# Altium schematic sheet USB_debug_schematic.SchDoc: USB UART debug circuit
size A3; Organization: Altium Limited; Address1: L3, 12a Rodborough Rd; Address2: Frenchs Forest; Address3: NSW; Address4: Australia 2086; DocumentNumber: 8; SheetNumber: 8; SheetTotal: 8
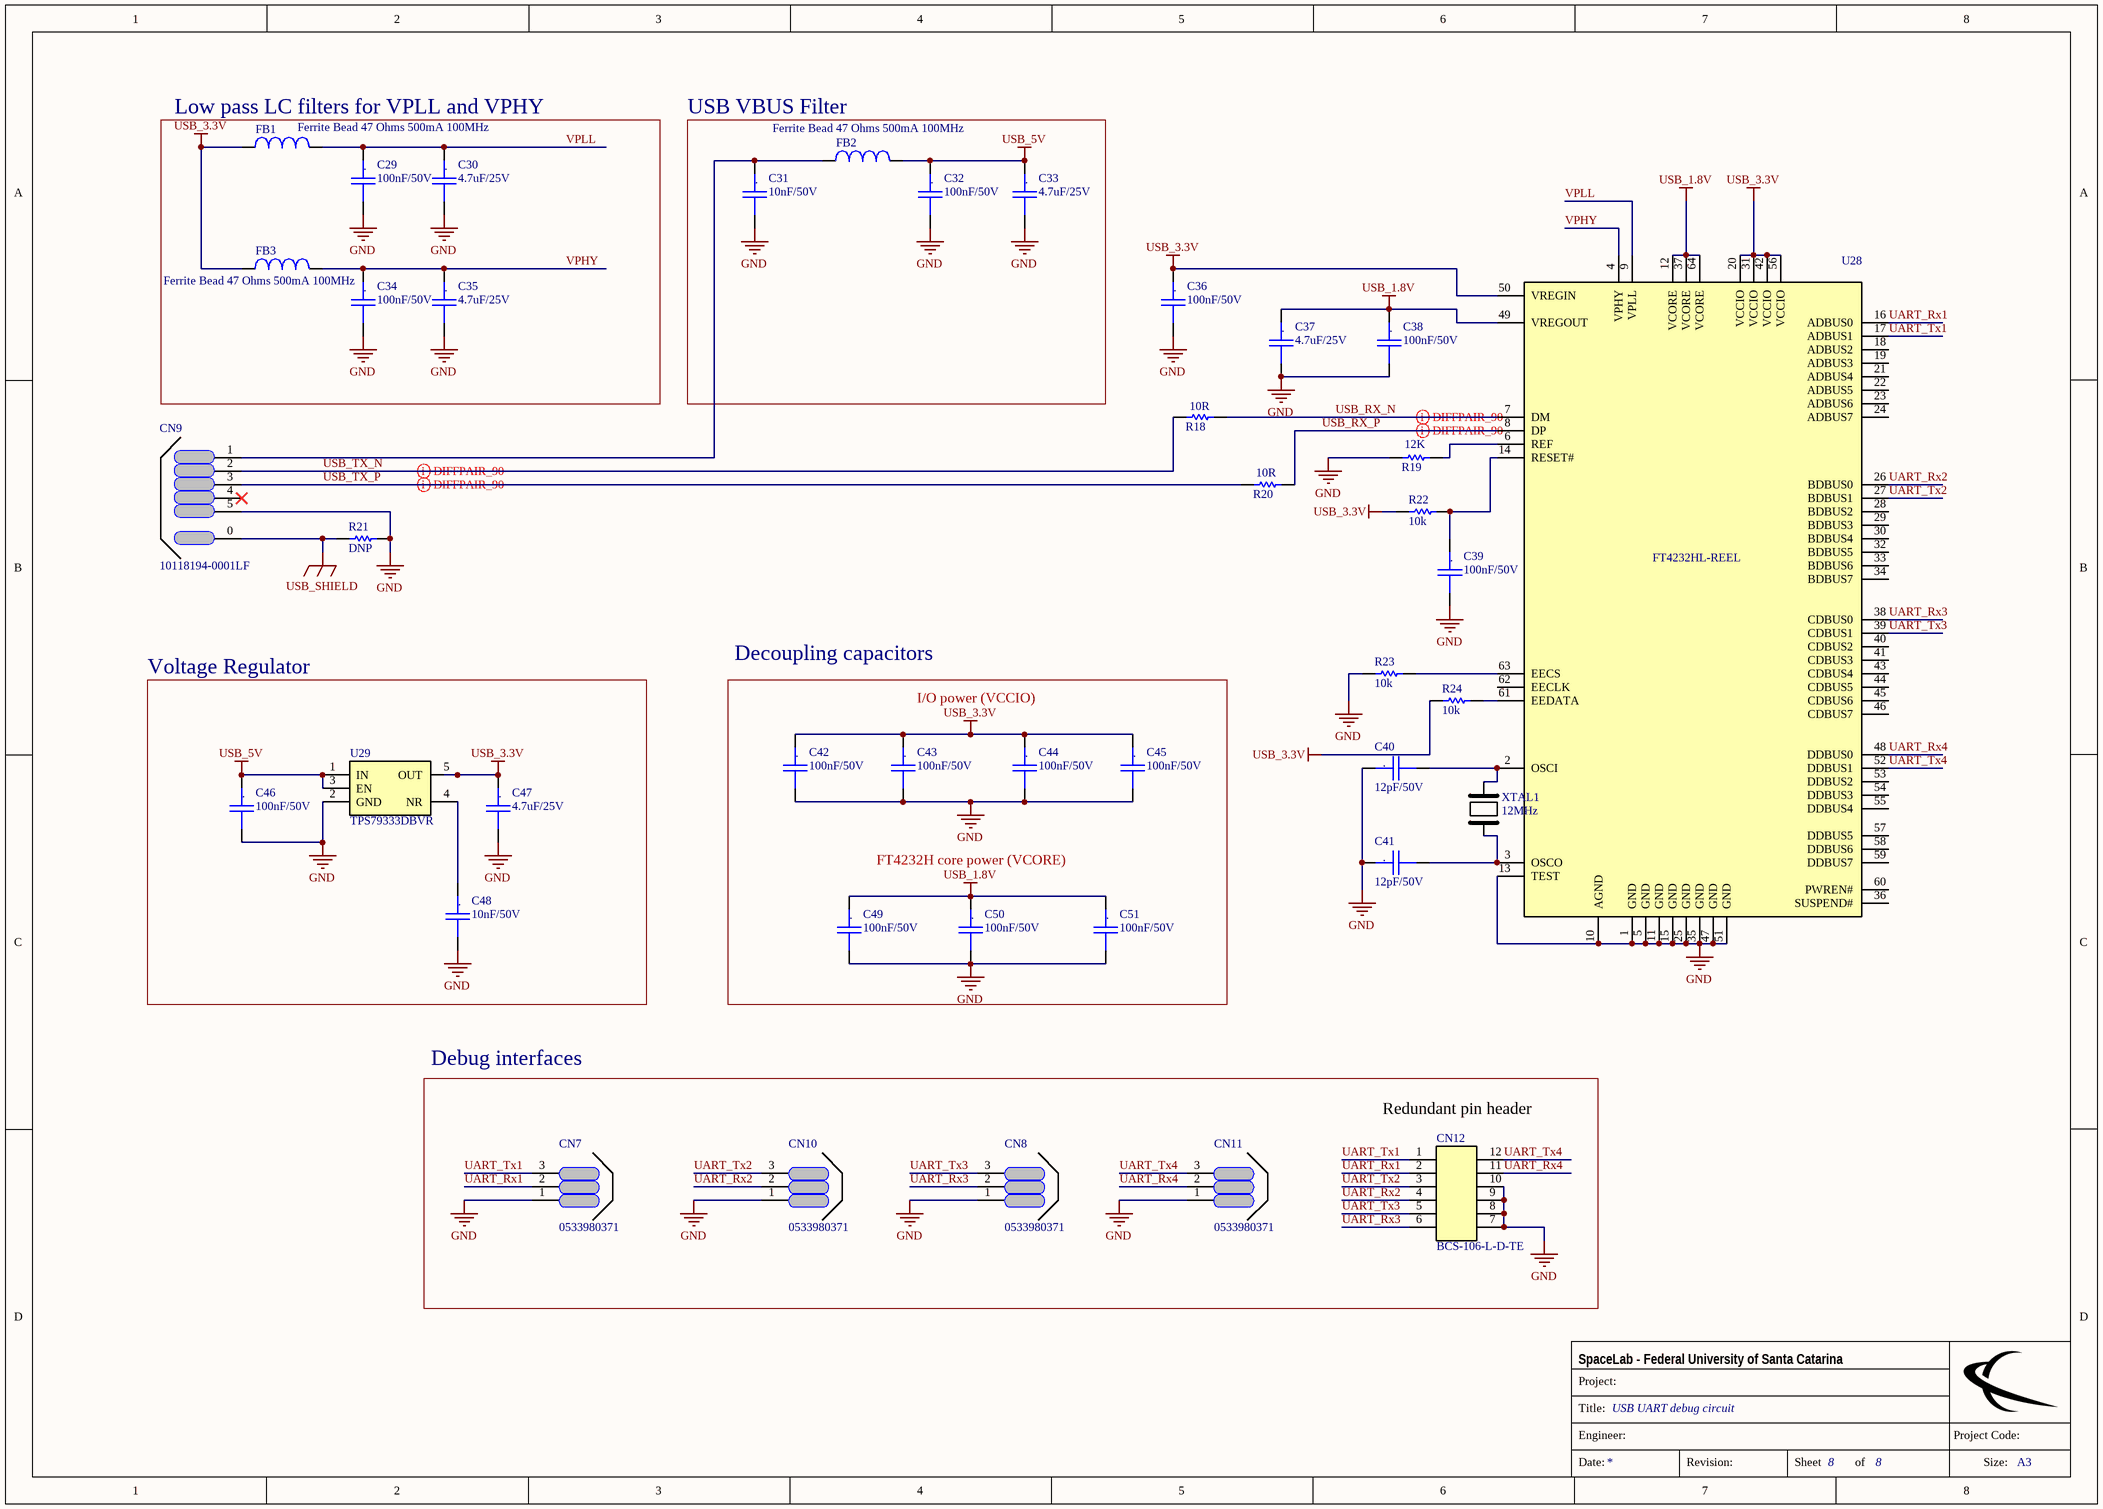
[diagram p0: USB_debug_schematic.SchDoc]

## Parts
C29  100nF/50V  [CC0603]
C30  4.7uF/25V  [CC0805]
C31  10nF/50V  [CC0805]
C32  100nF/50V  [CC0603]
C33  4.7uF/25V  [CC0805]
C34  100nF/50V  [CC0603]
C35  4.7uF/25V  [CC0805]
C36  100nF/50V  [CC0603]
C37  4.7uF/25V  [CC0805]
C38  100nF/50V  [CC0603]
C39  100nF/50V  [CC0603]
C40  12pF/50V  [CC0805]
C41  12pF/50V  [CC0805]
C42  100nF/50V  [CC0603]
C43  100nF/50V  [CC0603]
C44  100nF/50V  [CC0603]
C45  100nF/50V  [CC0603]
C46  100nF/50V  [CC0603]
C47  4.7uF/25V  [CC0805]
C48  10nF/50V  [CC0805]
C49  100nF/50V  [CC0603]
C50  100nF/50V  [CC0603]
C51  100nF/50V  [CC0603]
CN7  0533980371  [PICO BLADE 0533980371]
CN8  0533980371  [PICO BLADE 0533980371]
CN9  10118194-0001LF  [MICRO USB B 90GRAUS]
CN10  0533980371  [PICO BLADE 0533980371]
CN11  0533980371  [PICO BLADE 0533980371]
CN12  BCS-106-L-D-TE  [BCS-106-L-D-TE]
FB1  Ferrite Bead 47 Ohms 500mA 100MHz  [L0603]
FB2  Ferrite Bead 47 Ohms 500mA 100MHz  [L0603]
FB3  Ferrite Bead 47 Ohms 500mA 100MHz  [L0603]
R18  10R  [R0603_MD]
R19  12K  [R0805_MD]
R20  10R  [R0603_MD]
R21  DNP  [0805]
R22  10k  [0805]
R23  10k  [0805]
R24  10k  [0805]
U28  FT4232HL-REEL  [LQFP-64]
U29  TPS79333DBVR  [SOT23-5]
XTAL1  Frequency: 12MHz  [TXC 7A Series]  (hidden comment: 12.000MHz 12pF)

## Blocks framed on the sheet
Low pass LC filters for VPLL and VPHY: C29 C30 C34 C35 FB1 FB3
USB VBUS Filter: C31-C33 FB2
Voltage Regulator: C46-C48 U29
Decoupling capacitors: C42-C45 C49-C51
Debug interfaces: CN7 CN8 CN10-CN12

## Nets
GND: C29.2 C30.2 C31.2 C32.2 C33.2 C34.2 C35.2 C36.2 C37.2 C38.2 C39.2 C40.1 C41.1 C42.2 C43.2 C44.2 C45.2 C46.2 C47.2 C48.2 C49.2 C50.2 C51.2 CN7.1 CN8.1 CN9.5 CN10.1 CN11.1 CN12.7 CN12.8 CN12.9 CN12.10 R19.1 R21.1 R23.2 U28.1(GND) U28.5(GND) U28.10(AGND) U28.11(GND) U28.13(TEST) U28.15(GND) U28.25(GND) U28.35(GND) U28.47(GND) U28.51(GND) U29.2(GND)
USB_1.8V: C37.1 C38.1 C49.1 C50.1 C51.1 U28.12(VCORE) U28.37(VCORE) U28.49(VREGOUT) U28.64(VCORE)
USB_3.3V: C36.1 C42.1 C43.1 C44.1 C45.1 C47.1 FB1.1 FB3.1 R22.2 R24.2 U28.20(VCCIO) U28.31(VCCIO) U28.42(VCCIO) U28.50(VREGIN) U28.56(VCCIO) U29.5(OUT)
USB_5V: C32.1 C33.1 C46.1 FB2.2 U29.1(IN) U29.3(EN)
USB_SHIELD: CN9.0 R21.2
UART_Rx1: CN7.2 CN12.2 U28.16(ADBUS0)
UART_Rx2: CN10.2 CN12.4 U28.26(BDBUS0)
UART_Rx3: CN8.2 CN12.6 U28.38(CDBUS0)
UART_Rx4: CN11.2 CN12.11 U28.48(DDBUS0)
UART_Tx1: CN7.3 CN12.1 U28.17(ADBUS1)
UART_Tx2: CN10.3 CN12.3 U28.27(BDBUS1)
UART_Tx3: CN8.3 CN12.5 U28.39(CDBUS1)
UART_Tx4: CN11.3 CN12.12 U28.52(DDBUS1)
USB_RX_N: R18.2 U28.7(DM)
USB_RX_P: R20.2 U28.8(DP)
USB_TX_N: CN9.2 R18.1
USB_TX_P: CN9.3 R20.1
VPHY: C34.1 C35.1 FB3.2 U28.4(VPHY)
VPLL: C29.1 C30.1 FB1.2 U28.9(VPLL)
NetC31_1: C31.1 CN9.1 FB2.1
NetC39_1: C39.1 R22.1 U28.14(RESET#)
NetC40_2: C40.2 U28.2(OSCI) XTAL1.1
NetC41_2: C41.2 U28.3(OSCO) XTAL1.2
NetC48_1: C48.1 U29.4(NR)
NetR19_2: R19.2 U28.6(REF)
NetR23_1: R23.1 U28.63(EECS)
NetR24_1: R24.1 U28.61(EEDATA)

Not connected (* = marked no-connect by the designer): CN9 4*; U28 18(ADBUS2) 19(ADBUS3) 21(ADBUS4) 22(ADBUS5) 23(ADBUS6) 24(ADBUS7) 28(BDBUS2) 29(BDBUS3) 30(BDBUS4) 32(BDBUS5) 33(BDBUS6) 34(BDBUS7) 36(SUSPEND#) 40(CDBUS2) 41(CDBUS3) 43(CDBUS4) 44(CDBUS5) 45(CDBUS6) 46(CDBUS7) 53(DDBUS2) 54(DDBUS3) 55(DDBUS4) 57(DDBUS5) 58(DDBUS6) 59(DDBUS7) 60(PWREN#) 62(EECLK)

## Layout directives
differential pair: USB_RX_N, USB_RX_P, USB_TX_N, USB_TX_P

## Notes on the sheet
- I/O power (VCCIO)
- FT4232H core power (VCORE)
- (near CN12) Redundant pin header
- Project:
- SpaceLab - Federal University of Santa Catarina
- Title:
- Engineer:
- Project Code:
- Date:
- Revision:
- Sheet
- of
- Size:
- A3
- (in symbol Cap_Cer_X7R_4.7uF_25V_0805) .
- (in symbol Cap_Cer_X7R_10nF_50V_0805) .
- (in symbol Cap_Cer_X7R_12pF_50V_0805) .
- (in symbol Cap_Cer_X7R_100nF_50V_0603) .

## Library data of the parts
C29 C32 C34 C36 C38 C39 C42-C46 C49-C51 = Cap_Cer_X7R_100nF_50V_0603: CAP CER 100nF 50V 10% X7R 0603; Manufacturer Part Number: C0603C104K5RAC3121; NCM: 8532.24.10
C30 C33 C35 C37 C47 = Cap_Cer_X7R_4.7uF_25V_0805: CAP CER 4.7uF 25V 10% X7R 0805; Manufacturer Part Number: C0805C475K3RACAUTO; NCM: 8532.24.10
C31 C48 = Cap_Cer_X7R_10nF_50V_0805: CAP CER 0.01uF 50V 10% X7R 0805; Manufacturer Part Number: 08055C103KAT4A; NCM: 8532.24.10
C40 C41 = Cap_Cer_X7R_12pF_50V_0805: CAP CER 12pF 50V 1% C0G/NP0 0805; Manufacturer Part Number: CL21C120FBANNNC; NCM: 8532.24.10
CN7 CN8 CN10 CN11 = 0533980371: CONN HEADER SMD 3POS 1.25MM; Manufacturer: Molex; Manufacturer Part Number: 53398-0371; N of Positions: 3; Pitch: 1.25mm; Mount Type: SMD; Value: 0533980371
CN9 = 10118194-0001LF: CONN USB MICRO B RECPT SMT R/A; Manufacturer: FCI; N of Positions: 5; Pitch: 0.65mm; Mount Type: PTH; Supplier 1: Digi-Key; Supplier 2: Farnell; Supplier 3: Mouser; Supplier 4: Newark; Supplier Part Number 1: 609-4618-1-ND; Supplier Part Number 2: 1645325; Supplier Part Number 3: 649-10118194-0001LF; Supplier Part Number 4: 67T2260; Manufacturer Part Number: 10118194-0001LF
CN12 = BCS-106-L-D-TE: CONN RCPT 12POS 0.1 GOLD PCB; Manufacturer: Samtec; Number of Contacts: 12; Gender: Receptacle; Max Current Rating: 5.9A; Contact Resistance: 10mR; Max Voltage Rating (AC): 475V; Pitch: 2.54mm; Row Spacing: 0.1inch; Supplier 1: Digi-Key; Manufacturer Part Number: BCS-106-L-D-TE; RoHS: Yes; Category: Connectors; Stock 1: 7411; Pricing 1: 1=1.77000, 10=1.60200, 25=1.50360, 50=1.43820, 100=1.37290, 250=1.24216, 500=1.14408 (USD); Mount: Through Hole; Contact Plating: Gold; Contact Material: Bronze; Color: Black; Housing Color: Black; Housing Material: Polymer; Min Operating Temperature: -55°C; Max Operating Temperature: 125°C; Number of Rows: 2; Termination: Solder; Packaging: Rail/Tube; Connector Type: Receptacle; Number of Positions: 12; Orientation: Vertical; Length: 15.24mm; Depth: 5.08mm; Width: 5.08mm; Radiation Hardening: No; REACH SVHC: No SVHC; Lead Free: Lead Free; ComponentLink1URL: https://datasheet.ciiva.com/16706/bcs-16706444.pdf?src-supplier=Avnet+Europe; ComponentLink1Description: https://datasheet.ciiva.com/16706/bcs-16706444.pdf?src-supplier=Avnet+Europe; ComponentLink2URL: https://datasheet.ciiva.com/413/bcs-1xx-xxx-x-xx-xxx-mkt-413758.pdf?src-supplier=Digi-Key; ComponentLink2Description: https://datasheet.ciiva.com/413/bcs-1xx-xxx-x-xx-xxx-mkt-413758.pdf?src-supplier=Digi-Key; Supplier Part Number 1: SAM1008-06-ND
FB1-FB3 = 742792608: WURTH ELEKTRONIK   742792608   FERRITE BEAD, 47 OHM, 0.5A, 0603; Manufacturer: Wurth Electronics; Resistance: 100mR; Inductance: 1H; Tolerance: 25%; Number of Lines: 1; Supplier 1: Digi-Key; Supplier Part Number 1: 732-1596-1-ND; Stock 1: 969; Pricing 1: 1=0.17, 50=0.168, 100=0.155, 500=0.148, 1000=0.141, 2000=0.134 (USD); Mount: Surface Mount; Case/Package: SMD/SMT; Weight: 0.000141oz; Core Material: Ferrite; Case Code (Metric): 1608; Case Code (Imperial): 0603; Material: Ferrite; Min Operating Temperature: -55°C; Max Operating Temperature: 125°C; Package Quantity: 1; Packaging: Tape and Reel; Max Current Rating: 500mA; DC Resistance (DCR): 100mR; Max DC Current: 500mA; Termination: SMD/SMT; Length: 1.6mm; Height: 0.8mm; Width: 0.8mm; Depth: 0.8mm; REACH SVHC: Unknown; Lead Free: Lead Free; ComponentLink1URL: http://katalog.we-online.de/pbs/datasheet/742792608.pdf?src-supplier=Digi-Key; ComponentLink1Description: http://katalog.we-online.de/pbs/datasheet/742792608.pdf?src-supplier=Digi-Key; ComponentLink2URL: http://www.farnell.com/datasheets/2290671.pdf?src-supplier=Farnell; ComponentLink2Description: http://www.farnell.com/datasheets/2290671.pdf?src-supplier=Farnell; ComponentLink3URL: http://documents.rs-components.com/techlib://itc_doclist_GB.htm?stockno=6693986&src-supplier=RSComponents; ComponentLink3Description: http://documents.rs-components.com/techlib://itc_doclist_GB.htm?stockno=6693986&src-supplier=RSComponents; ComponentLink4URL: http://www.farnell.com/datasheets/1696033.pdf?src-supplier=Element14; ComponentLink4Description: http://www.farnell.com/datasheets/1696033.pdf?src-supplier=Element14; ComponentLink5URL: http://www.mouser.com/ds/2/445/742792608-538481.pdf?src-supplier=Mouser; ComponentLink5Description: http://www.mouser.com/ds/2/445/742792608-538481.pdf?src-supplier=Mouser; ComponentLink6URL: http://www.farnell.com/datasheets/2290671.pdf?src-supplier=Newark; ComponentLink6Description: http://www.farnell.com/datasheets/2290671.pdf?src-supplier=Newark; Supplier 2: Mouser; Supplier Part Number 2: 710-742792608; Stock 2: 6414; Pricing 2: 1=0.18, 10=0.172, 25=0.172, 50=0.168, 100=0.155, 250=0.155 (USD); Manufacturer Part Number: 742792608
R18 R20 = RC0603FR-0710RL: RES 10R OHM 1/10W 1% 0603; Manufacturer: Yageo; Temperature Coefficient: 200ppm/°C; Voltage Rating (DC): 50V; Power Rating: 100mW; Supplier 1: Digi-Key; Supplier Part Number 1: 311-10.0HRCT-ND; Stock 1: 9251104; Pricing 1: 1=0.1, 10=0.046, 100=0.0187, 1000=0.0084, 2500=0.00729 (USD); Case/Package: 0603; Number of Pins: 2; Case Code (Imperial): 0603; Case Code (Metric): 1608; Contact Plating: Tin,Matte; Min Operating Temperature: -55°C; Max Operating Temperature: 155°C; Tolerance: 1%; Composition: Thick Film; Packaging: Tape and Reel; Voltage Rating: 50V; Termination: SMD/SMT; Military Standard: Not; Length: 1.6mm; Height: 0.45mm; Width: 0.8mm; Depth: 0.8mm; Radiation Hardening: No; Lead Free: Lead Free; REACH SVHC: No SVHC; ComponentLink1URL: http://www.farnell.com/datasheets/1868787.pdf?src-supplier=Element14; ComponentLink1Description: http://www.farnell.com/datasheets/1868787.pdf?src-supplier=Element14; ComponentLink2URL: http://www.yageo.com/documents/recent/PYu-RC0603_51_RoHS_L_4.pdf?src-supplier=Avnet; ComponentLink2Description: http://www.yageo.com/documents/recent/PYu-RC0603_51_RoHS_L_4.pdf?src-supplier=Avnet; ComponentLink3URL: http://documents.rs-components.com/techlib://itc_doclist_GB.htm?stockno=5048984&src-supplier=RSComponents; ComponentLink3Description: http://documents.rs-components.com/techlib://itc_doclist_GB.htm?stockno=5048984&src-supplier=RSComponents; ComponentLink4URL: http://www.yageo.com/documents/recent/PYu-RC0603_51_RoHS_L_4.pdf?src-supplier=Avnet+Europe; ComponentLink4Description: http://www.yageo.com/documents/recent/PYu-RC0603_51_RoHS_L_4.pdf?src-supplier=Avnet+Europe; Supplier 2: Mouser; Supplier Part Number 2: 603-RC0603FR-0710RL; Stock 2: 267888; Pricing 2: 1=0.15, 10=0.036, 100=0.012, 1000=0.009, 5000=0.006, 10000=0.006 (USD); Manufacturer Part Number: RC0603FR-0710RL
R19 = RMCF0805FT12K0: RES 12K OHM 1/8W 1% 0805; Manufacturer: Stackpole Electronics; Power Rating: 125mW; Temperature Coefficient: 100ppm/°C; Supplier 1: Digi-Key; Supplier Part Number 1: RMCF0805FT12K0CT-ND; Stock 1: 30304; Pricing 1: 1=0.1, 10=0.026, 100=0.0104, 1000=0.00466, 2500=0.00405 (USD); Mount: Surface Mount; Case/Package: 0805; Case Code (Metric): 2012; Case Code (Imperial): 0805; Contact Plating: Tin,Matte; Min Operating Temperature: -55°C; Max Operating Temperature: 155°C; Packaging: Tape and Reel; Composition: Thick Film; Number of Terminations: 2; Max Power Dissipation: 125mW; Features: Automotive AEC-Q200; Length: 0.079inch; Height: 0.026inch; Width: 0.049inch; Radiation Hardening: No; Lead Free: Lead Free; ComponentLink1URL: https://www.seielect.com/catalog/SEI-RMCF_RMCP.pdf?src-supplier=Avnet; ComponentLink1Description: https://www.seielect.com/catalog/SEI-RMCF_RMCP.pdf?src-supplier=Avnet; ComponentLink2URL: https://www.seielect.com/Catalog/SEI-RMCF_RMCP.pdf?src-supplier=Digi-Key; ComponentLink2Description: https://www.seielect.com/Catalog/SEI-RMCF_RMCP.pdf?src-supplier=Digi-Key; ComponentLink3URL: https://www.seielect.com/catalog/SEI-Packaging.pdf?src-supplier=Digi-Key; ComponentLink3Description: https://www.seielect.com/catalog/SEI-Packaging.pdf?src-supplier=Digi-Key; ComponentLink4URL: http://seielect.com/Catalog/SEI-RMCF_RMCP.pdf?src-supplier=Future+Electronics; ComponentLink4Description: http://seielect.com/Catalog/SEI-RMCF_RMCP.pdf?src-supplier=Future+Electronics; ComponentLink5URL: http://components.arrow.com/part/dataview/40964023S7542466N1174?src-supplier=Arrow; ComponentLink5Description: http://components.arrow.com/part/dataview/40964023S7542466N1174?src-supplier=Arrow; Manufacturer Part Number: RMCF0805FT12K0; Tolerance: 1%
R21 = RDNP_0805: RES DNP 0805; Manufacturer Part Number: CRCW08050000Z0EA; NCM: 8533.21.20
R22-R24 = R10k_1%_1/8W_0805: RES 10K OHM 1/8W 1%  0805; Manufacturer Part Number: CRCW080510K0FKEA; NCM: 8533.21.20
U28 = FT4232HL-REEL: FTDI - FT4232HL-REEL - USB-UART/MPSSE, 4232, QUAD, 64LQFP; Number of Channels: 1; Data Rate: 480Mbps; Operating Supply Voltage: 3.3V; Max Supply Voltage: 3.63V; Min Supply Voltage: 1.62V; Operating Supply Current: 70mA; Number of Transceivers: 4; ESD Protection: Yes; Interface: UART; Supplier 1: Digi-Key; Supplier Part Number 1: 768-1026-1-ND; Manufacturer: FTDI; Stock 1: 18748; Pricing 1: 1=8.3, 10=8.09, 50=7.46, 100=7.14, 500=6.88006 (USD); Mount: Surface Mount; Case/Package: LQFP; Number of Pins: 64; Weight: 0.012088oz; Min Operating Temperature: -40°C; Max Operating Temperature: 85°C; Packaging: Tape and Reel; Package Quantity: 1000; Dual Supply Voltage: 3.3V; Length: 10.1mm; Height: 1.4mm; Width: 10.1mm; Radiation Hardening: No; Lead Free: Lead Free; ComponentLink1URL: http://www.ftdichip.com/Support/Documents/AppNotes/AN_128_User_Guide_For_FT4232H_Factory%20test%20utility.pdf?src-supplier=Digi-Key; ComponentLink1Description: http://www.ftdichip.com/Support/Documents/AppNotes/AN_128_User_Guide_For_FT4232H_Factory%20test%20utility.pdf?src-supplier=Digi-Key; ComponentLink2URL: http://www.alliedelec.com/images/products/datasheets/bm/FTDI/70403916.pdf?src-supplier=Allied+Electronics; ComponentLink2Description: http://www.alliedelec.com/images/products/datasheets/bm/FTDI/70403916.pdf?src-supplier=Allied+Electronics; ComponentLink3URL: http://www.ftdichip.com/Support/Documents/DataSheets/ICs/DS_FT4232H.pdf?src-supplier=Future+Electronics; ComponentLink3Description: http://www.ftdichip.com/Support/Documents/DataSheets/ICs/DS_FT4232H.pdf?src-supplier=Future+Electronics; ComponentLink4URL: https://www.verical.com/server-webapp/html/getDatasheet?partID=643215&src-supplier=Verical; ComponentLink4Description: https://www.verical.com/server-webapp/html/getDatasheet?partID=643215&src-supplier=Verical; ComponentLink5URL: http://datasheet.iiic.cc/ftdi/FT4232HL-REEL.pdf?src-supplier=IIIC; ComponentLink5Description: http://datasheet.iiic.cc/ftdi/FT4232HL-REEL.pdf?src-supplier=IIIC; Supplier 2: Mouser; Supplier Part Number 2: 895-FT4232HL; Stock 2: 21282; Pricing 2: 1=8.3, 25=8.09, 50=7.46, 100=7.14, 500=6.88, 1000=6.08 (USD); Manufacturer Part Number: FT4232HL-REEL
U29 = TPS79333DBVR: TEXAS INSTRUMENTS - TPS79333DBVR - IC, V REG, LINEAR, 0.2A, SOT-23-5; Number of Outputs: 1; Output Voltage: 3.3V; Max Power Dissipation: 560mW; Max Output Current: 200mA; Max Input Voltage: 5.5V; Min Input Voltage: 2.7V; Polarity: Positive; Quiescent Current: 200uA; Accuracy: 2%; Output Type: Fixed; Dropout Voltage: 102mV; Min Current Limit: 285mA; Input Bias Current: 170uA; Supplier 1: Digi-Key; Supplier Part Number 1: 296-12961-1-ND; Manufacturer: Texas Instruments; Stock 1: 21565; Pricing 1: 1=0.73, 10=0.64, 25=0.6016, 100=0.4559, 250=0.388, 500=0.3686, 1000=0.2813 (USD); Case/Package: SOT-23; Number of Pins: 5; Min Operating Temperature: -40°C; Max Operating Temperature: 125°C; Output Current: 200mA; Packaging: Tape and Reel; Package Quantity: 1; Number of Regulators: 1; Min Output Voltage: 3.3V; Power Dissipation: 560mW; Max Output Voltage: 3.3V; Output Voltage Accuracy: 2%; Nominal Output Voltage: 3.3V; Power Rating: 560mW; Max Supply Voltage: 5.5V; Min Supply Voltage: 2.7V; Termination: SMD/SMT; Current Rating: 200mA; Length: 2.9mm; Height: 1.15mm; Width: 1.6mm; Radiation Hardening: No; Lead Free: Lead Free; REACH SVHC: No SVHC; ComponentLink1URL: http://www.ti.com/general/docs/lit/getliterature.tsp?genericPartNumber=TPS793&amp;&amp;fileType=pdf&src-supplier=Farnell; ComponentLink1Description: http://www.ti.com/general/docs/lit/getliterature.tsp?genericPartNumber=TPS793&amp;&amp;fileType=pdf&src-supplier=Farnell; ComponentLink2URL: http://www.jameco.com/Jameco/Products/ProdDS/1123416.pdf?src-supplier=Jameco; ComponentLink2Description: http://www.jameco.com/Jameco/Products/ProdDS/1123416.pdf?src-supplier=Jameco; Supplier 2: Mouser; Supplier Part Number 2: 595-TPS79333DBVR; Stock 2: 31707; Pricing 2: 1=0.72, 10=0.6, 100=0.379, 1000=0.289, 2000=0.282, 3000=0.252, 9000=0.242, 48000=0.233 (USD); Manufacturer Part Number: TPS79333DBVR
XTAL1 = AA-12.000MAGE-T: Crystals 12.000MHz 30ppm 12pF -40C to 85C; Manufacturer: TXC; ESR (Equivalent Series Resistance): 100R; Frequency Stability: 50ppm; Supplier 1: Digi-Key; Supplier Part Number 1: 887-1656-1-ND; Stock 1: 2398; Pricing 1: 1=0.83, 10=0.734, 50=0.6858, 100=0.6061, 500=0.5742 (USD); Mount: Surface Mount; Case/Package: SMD/SMT; Number of Pins: 2; Min Operating Temperature: -40°C; Max Operating Temperature: 85°C; Package Quantity: 1000; Tolerance: 30ppm; Packaging: Tape and Reel; Frequency Tolerance: 30ppm; Termination: SMD/SMT; Length: 0.197inch; Height: 0.053inch; Width: 3.2mm; Ratings: AEC-Q200; REACH SVHC: No SVHC; ComponentLink1URL: http://www.txccrystal.com/images/pdf/number-crystal-automotive.pdf?src-supplier=Digi-Key; ComponentLink1Description: http://www.txccrystal.com/images/pdf/number-crystal-automotive.pdf?src-supplier=Digi-Key; ComponentLink2URL: http://www.farnell.com/datasheets/1811860.pdf?src-supplier=Element14; ComponentLink2Description: http://www.farnell.com/datasheets/1811860.pdf?src-supplier=Element14; Supplier 2: Mouser; Supplier Part Number 2: 717-AA-12.000MAGE-T; Stock 2: 4856; Pricing 2: 1=0.83, 10=0.734, 50=0.685, 100=0.606, 500=0.574, 1000=0.435 (USD); Manufacturer Part Number: AA-12.000MAGE-T